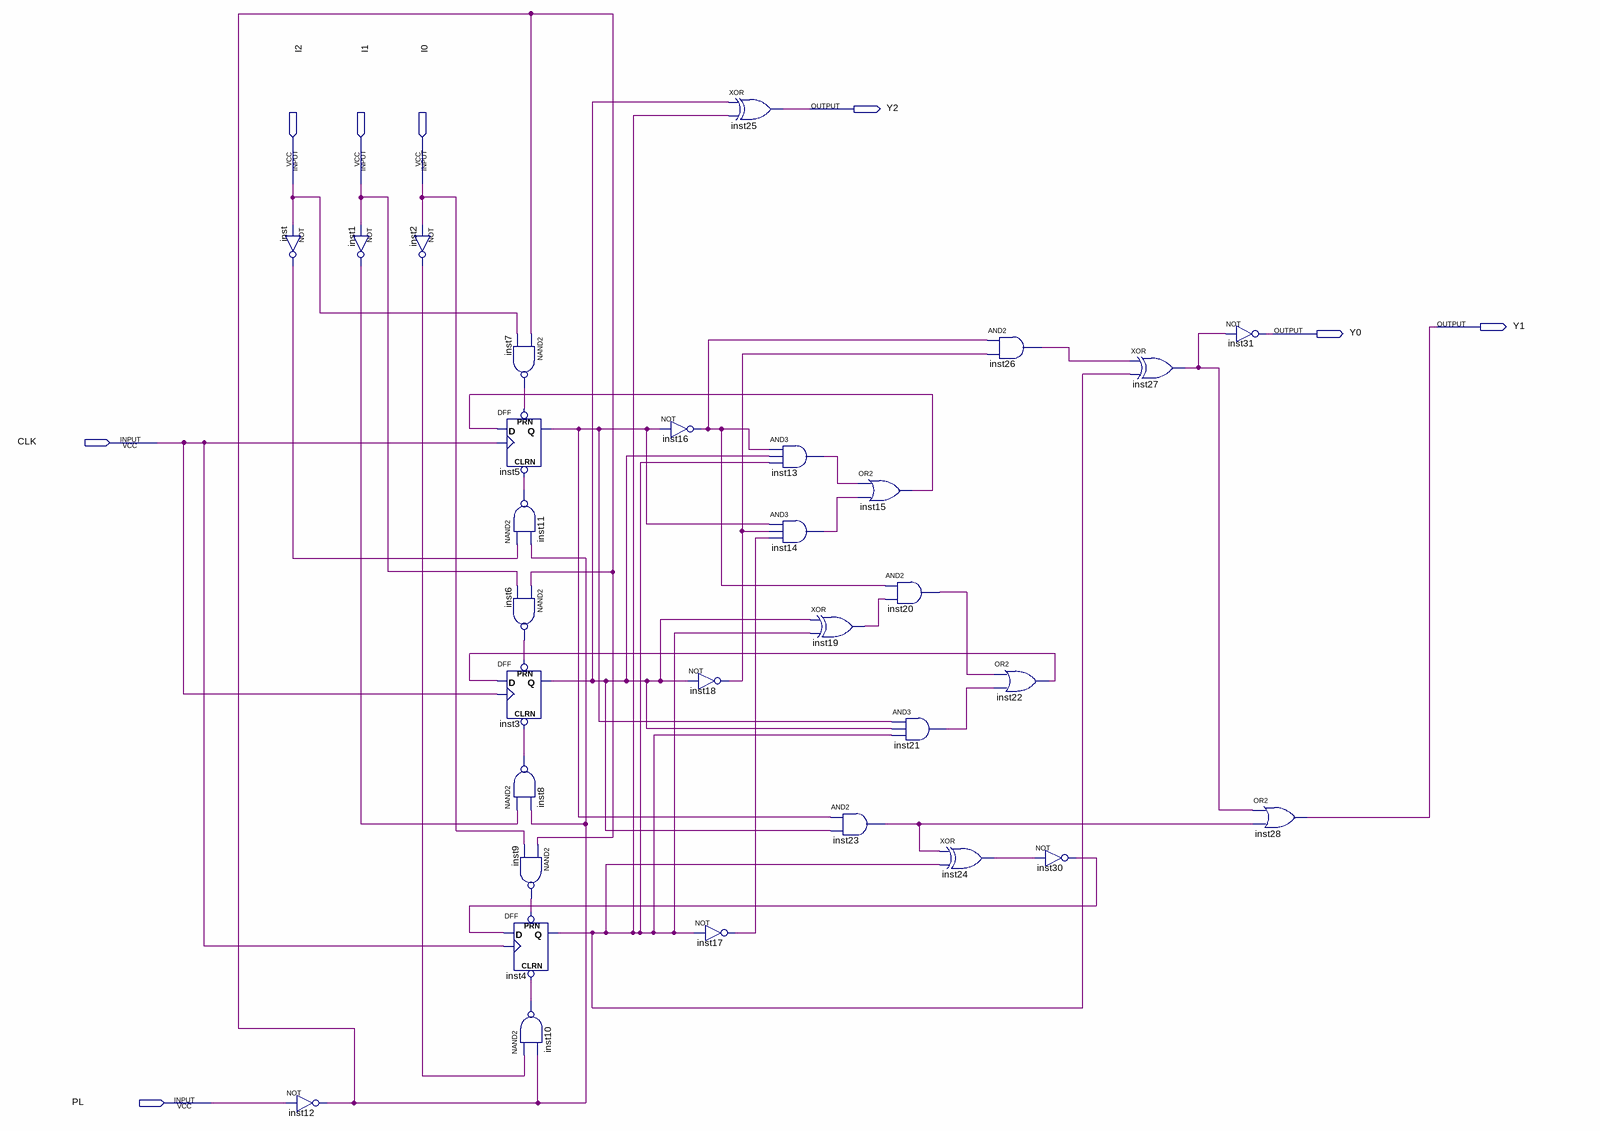
[diagram p0: schematic sheet]
// Quartus schematic Lab1.bdf as structural Verilog: 31 symbols, 8 pins
module Lab1 (
  input  I2,
  input  I1,
  input  I0,
  input  CLK,
  input  PL,
  output Y2,
  output Y1,
  output Y0
);

  wire inst1_out, inst2_out, inst3_q, inst4_q, inst5_q, inst6_out, inst7_out, inst8_out, inst9_out,
       inst10_out, inst11_out, inst12_out, inst13_out, inst14_out, inst15_out, inst16_out, inst17_out,
       inst18_out, inst19_out, inst20_out, inst21_out, inst22_out, inst23_out, inst24_out, inst26_out,
       inst27_out, inst30_out, inst_out;

  not inst (inst_out, I2);
  not inst12 (inst12_out, PL);
  not inst1 (inst1_out, I1);
  not inst2 (inst2_out, I0);
  nand inst7 (inst7_out, inst12_out, I2);
  DFF inst5 (.CLRN(inst11_out), .CLK(CLK), .D(inst15_out), .PRN(inst7_out), .Q(inst5_q));
  nand inst11 (inst11_out, inst_out, inst12_out);
  nand inst6 (inst6_out, inst12_out, I1);
  DFF inst3 (.CLRN(inst8_out), .CLK(CLK), .D(inst22_out), .PRN(inst6_out), .Q(inst3_q));
  nand inst8 (inst8_out, inst1_out, inst12_out);
  DFF inst4 (.CLRN(inst10_out), .CLK(CLK), .D(inst30_out), .PRN(inst9_out), .Q(inst4_q));
  nand inst9 (inst9_out, inst12_out, I0);
  nand inst10 (inst10_out, inst2_out, inst12_out);
  not inst16 (inst16_out, inst5_q);
  not inst18 (inst18_out, inst3_q);
  not inst17 (inst17_out, inst4_q);
  xor inst25 (Y2, inst3_q, inst4_q);
  and inst13 (inst13_out, inst16_out, inst3_q, inst4_q);
  and inst14 (inst14_out, inst5_q, inst18_out, inst17_out);
  xor inst19 (inst19_out, inst3_q, inst4_q);
  and inst23 (inst23_out, inst5_q, inst3_q);
  or inst15 (inst15_out, inst13_out, inst14_out);
  and inst20 (inst20_out, inst16_out, inst19_out);
  and inst21 (inst21_out, inst5_q, inst3_q, inst4_q);
  xor inst24 (inst24_out, inst23_out, inst4_q);
  and inst26 (inst26_out, inst16_out, inst18_out);
  or inst22 (inst22_out, inst20_out, inst21_out);
  not inst30 (inst30_out, inst24_out);
  xor inst27 (inst27_out, inst26_out, inst4_q);
  not inst31 (Y0, inst27_out);
  or inst28 (Y1, inst27_out, inst23_out);
endmodule
